# Altium schematic sheet Temperature sensing and heater power.SchDoc
size A
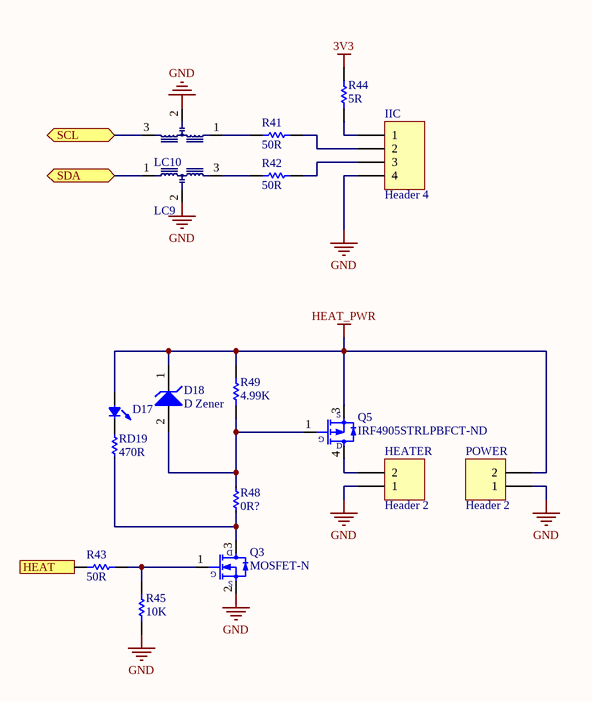
[diagram p0: Temperature sensing and heater power.SchDoc]

## Parts
D17  LED0  [0603 SMT LED]  (value not drawn)
D18  D Zener  [SOD123/X.85]
HEATER  Header 2  [Molex Mini-Fit Jr 5569 - 2 Pin, RA]
IIC  Header 4  [AMPModu MTE 4 Pin Shrouded Header]
LC9  MEM2012F  [MEM2012S LC Filter]  (value not drawn)
LC10  MEM2012F  [MEM2012S LC Filter]  (value not drawn)
POWER  Header 2  [Molex Mini-Fit Jr 5569 - 2 Pin, RA]
Q3  MOSFET-N  [SOT23-3N]
Q5  IRF4905STRLPBFCT-ND  [TO254P1520-3_4N]
R41  value 50R  [0603R]  (hidden comment: Res Semi)
R42  value 50R  [0603R]  (hidden comment: Res Semi)
R43  value 50R  [0603R]  (hidden comment: Res Semi)
R44  value 5R  [1206R]  (hidden comment: Res Semi)
R45  value 10K  [0603R]  (hidden comment: Res Semi)
R48  value 0R?  [0603R]  (hidden comment: Res Semi Small)
R49  value 4.99K  [1206R]  (hidden comment: Res Semi)
RD19  value 470R  [0603R]  (hidden comment: Res Semi Small)

## Ports
HEAT (in), SCL (bidir), SDA (bidir)

## Nets
3V3: R44.2
GND: HEATER.1 IIC.4 LC9.2 LC10.2 POWER.1 Q3.2(S) R45.1
HEAT_PWR: D17.1 D18.1(A) POWER.2 Q5.3(D) R49.2
HEAT: R43.1 ; port HEAT
SCL: LC10.3 ; port SCL
SDA: LC9.1 ; port SDA
NetD17_2: D17.2 RD19.1
NetD18_2: D18.2(K) Q5.1(G) R48.1 R49.1
NetHEATER_2: HEATER.2 Q5.4(S)
NetIIC_1: IIC.1 R44.1
NetIIC_2: IIC.2 R41.2
NetIIC_3: IIC.3 R42.2
NetLC9_3: LC9.3 R42.1
NetLC10_1: LC10.1 R41.1
NetQ3_1: Q3.1(G) R43.2 R45.2
NetQ3_3: Q3.3(D) R48.2 RD19.2

## Library data of the parts
D17 = LED0: T 1 3/4 LED; Published: 8-Jun-2000; LatestRevisionDate: 08-Jul-2005; LatestRevisionNote: Mech Layer 1 removed.; PackageReference: LED-0; Publisher: Altium Limited
D18 = D Zener: Zener Diode; Published: 8-Jun-2000; LatestRevisionDate: 17-Jul-2002; LatestRevisionNote: Re-released for DXP Platform.; PackageReference: DIODE-0.7; Publisher: Altium Limited
HEATER POWER = Header 2: Header, 2-Pin; LatestRevisionDate: 17-Jul-2002; LatestRevisionNote: Re-released for DXP Platform.; Publisher: Altium Limited
IIC = Header 4: Header, 4-Pin; LatestRevisionDate: 17-Jul-2002; LatestRevisionNote: Re-released for DXP Platform.; Publisher: Altium Limited
LC9 LC10 = MEM2012F - Signal Filter: Signal Line 3-terminal Filters
Q3 = MOSFET-N: N-Channel MOSFET; Published: 8-Jun-2000; LatestRevisionDate: 17-Jul-2002; LatestRevisionNote: Re-released for DXP Platform.; PackageVersion: 1995/1996; PackageReference: E3; Publisher: Altium Limited
Q5 = MOSFET-P: P-Channel MOSFET; Published: 8-Jun-2000; LatestRevisionDate: 17-Jul-2002; LatestRevisionNote: Re-released for DXP Platform.; PackageVersion: 1995/1996; PackageReference: E3; Publisher: Altium Limited
R41-R45 R49 = Res Semi: Semiconductor Resistor; Published: 8-Jun-2000; LatestRevisionDate: 17-Jul-2002; LatestRevisionNote: Re-released for DXP Platform.; PackageReference: AXIAL-0.5; Publisher: Altium Limited
R48 RD19 = Res Semi Small: Semiconductor Resistor; Published: 8-Jun-2000; LatestRevisionDate: 17-Jul-2002; LatestRevisionNote: Re-released for DXP Platform.; PackageReference: AXIAL-0.5; Publisher: Altium Limited